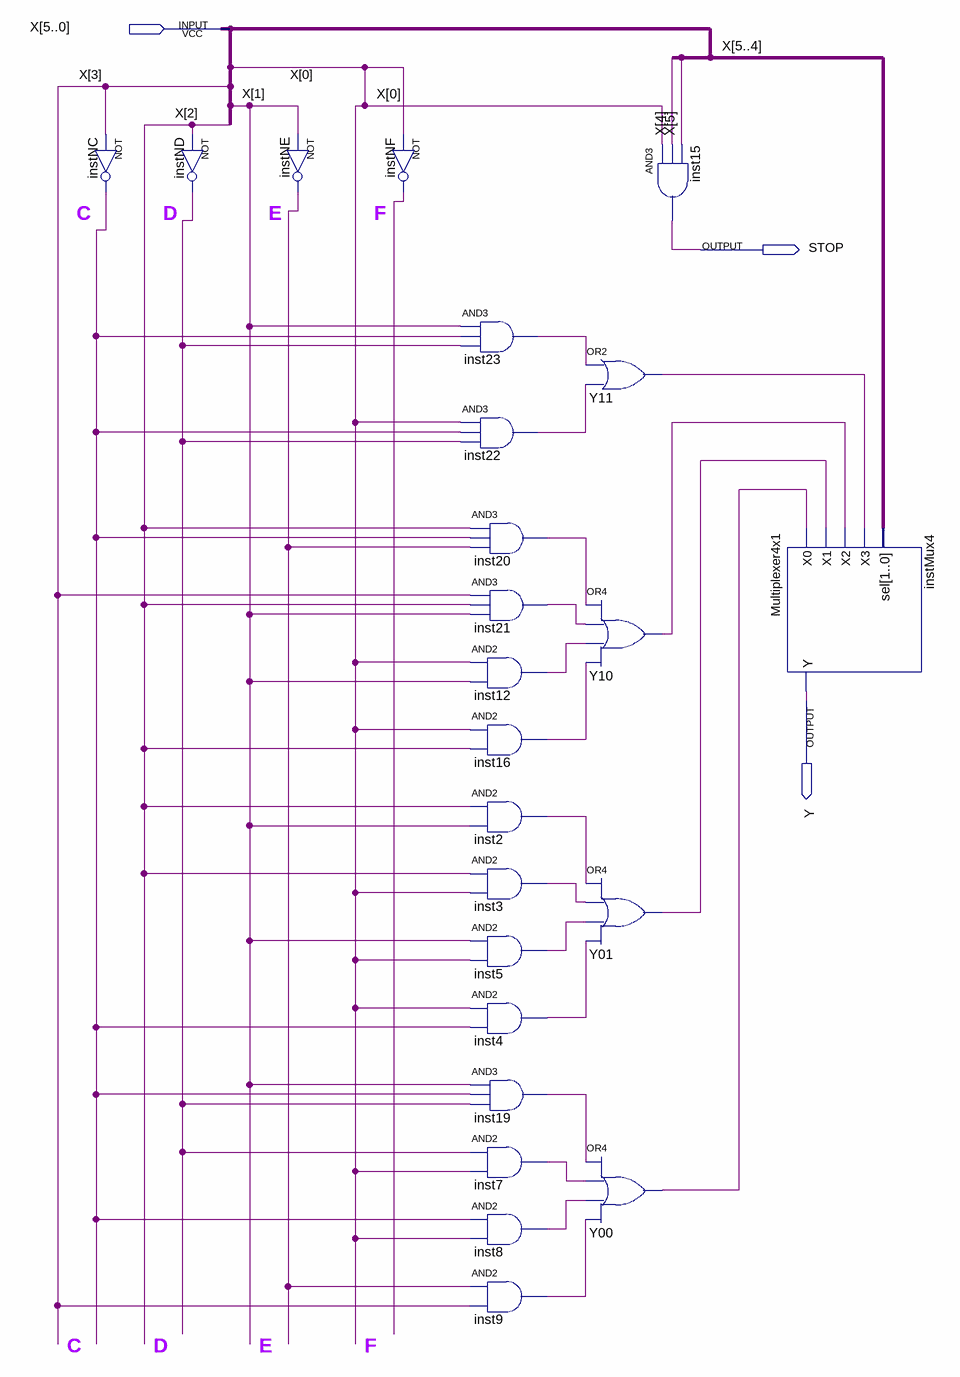
[diagram p0: schematic sheet]
// Quartus schematic MorseBDF_prototype.bdf as structural Verilog: 24 symbols, 3 pins
module MorseBDF_prototype (
  input  [5:0] X,
  output STOP,
  output Y
);

  wire inst2_out, inst3_out, inst4_out, inst5_out, inst7_out, inst8_out, inst9_out, inst12_out, inst16_out,
       inst19_out, inst20_out, inst21_out, inst22_out, inst23_out, instNC_out, instND_out, instNE_out,
       instNF_out, Y00_out, Y01_out, Y10_out, Y11_out;

  not instNC (instNC_out, X[3]);
  not instND (instND_out, X[2]);
  not instNE (instNE_out, X[1]);
  not instNF (instNF_out, X[0]);
  and inst23 (inst23_out, X[1], instNC_out, instND_out);
  and inst22 (inst22_out, X[0], instNC_out, instND_out);
  and inst20 (inst20_out, X[2], instNC_out, instNE_out);
  and inst21 (inst21_out, X[3], X[2], X[1]);
  and inst12 (inst12_out, X[0], X[1]);
  and inst16 (inst16_out, X[0], X[2]);
  and inst2 (inst2_out, X[2], X[1]);
  and inst3 (inst3_out, X[2], X[0]);
  and inst5 (inst5_out, X[1], X[0]);
  and inst4 (inst4_out, X[0], instNC_out);
  and inst19 (inst19_out, X[1], instNC_out, instND_out);
  and inst7 (inst7_out, instND_out, X[0]);
  and inst8 (inst8_out, instNC_out, X[0]);
  and inst9 (inst9_out, instNE_out, X[3]);
  or Y11 (Y11_out, inst23_out, inst22_out);
  or Y10 (Y10_out, inst20_out, inst21_out, inst12_out, inst16_out);
  or Y01 (Y01_out, inst2_out, inst3_out, inst5_out, inst4_out);
  or Y00 (Y00_out, inst19_out, inst7_out, inst8_out, inst9_out);
  and inst15 (STOP, X[0], X[4], X[5]);
  Multiplexer4x1 instMux4 (.X0(Y00_out), .X1(Y01_out), .X2(Y10_out), .X3(Y11_out), .sel(X[5:4]), .Y(Y));

  // Notes on the sheet:
  //   C
  //   D
  //   E
  //   F
  //   C
  //   D
  //   E
  //   F
endmodule
